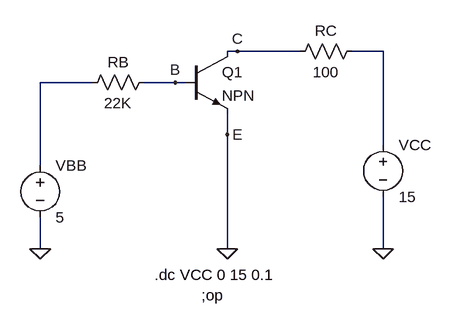
[diagram p0: schematic Circuito_P9.asc]
Circuito_P9.asc, the LTspice schematic file:
Version 4
SHEET 1 880 680
WIRE 352 128 336 128
WIRE 448 128 352 128
WIRE 576 128 528 128
WIRE 128 176 48 176
WIRE 256 176 208 176
WIRE 272 176 256 176
WIRE 336 256 336 224
WIRE 576 272 576 128
WIRE 48 304 48 176
WIRE 48 432 48 384
WIRE 336 432 336 256
WIRE 576 432 576 352
FLAG 48 432 0
FLAG 336 432 0
FLAG 576 432 0
FLAG 256 176 B
FLAG 352 128 C
FLAG 336 256 E
SYMBOL voltage 48 288 R0
WINDOW 123 0 0 Left 2
WINDOW 39 24 124 Left 2
SYMATTR InstName VBB
SYMATTR Value 5
SYMBOL voltage 576 256 R0
WINDOW 123 0 0 Left 2
WINDOW 39 0 0 Left 2
SYMATTR InstName VCC
SYMATTR Value 15
SYMBOL npn 272 128 R0
SYMATTR InstName Q1
SYMBOL res 544 112 R90
WINDOW 0 0 56 VBottom 2
WINDOW 3 32 56 VTop 2
SYMATTR InstName RC
SYMATTR Value 100
SYMBOL res 224 160 R90
WINDOW 0 0 56 VBottom 2
WINDOW 3 32 56 VTop 2
SYMATTR InstName RB
SYMATTR Value 22K
TEXT 224 472 Left 2 !.dc VCC 0 15 0.1
TEXT 296 504 Left 2 !;op

The netlist it stands for:
* Circuito_P9.asc
VBB N002 0 5
VCC N001 0 15
Q1 C B 0 0 NPN
RC N001 C 100
RB B N002 22K
.model NPN NPN
.model PNP PNP
.lib standard.bjt
.dc VCC 0 15 0.1
;op
.backanno
.end

* Results of the author's LTspice run, read from the files saved beside the schematic
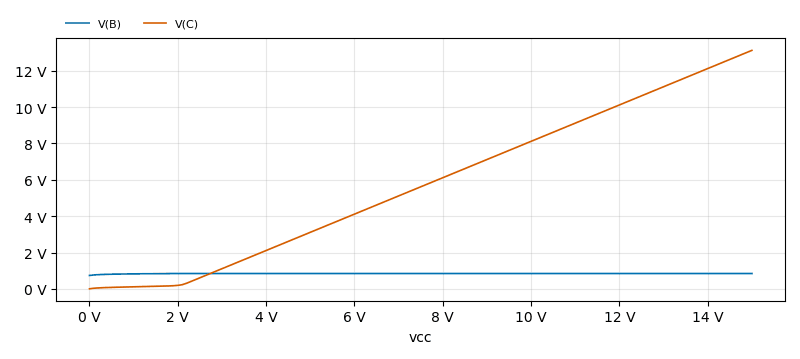
[diagram p1: DC transfer characteristic of Circuito_P9.asc, plotted from the saved traces]
* DC transfer characteristic, 1 run:
*   V(B): 741.4 mV at vcc=0 V, 850.2 mV at vcc=15 V, min 741.4 mV, max 850.2 mV
*   V(C): 10.03 mV at vcc=0 V, 13.11 V at vcc=15 V, min 10.03 mV, max 13.11 V